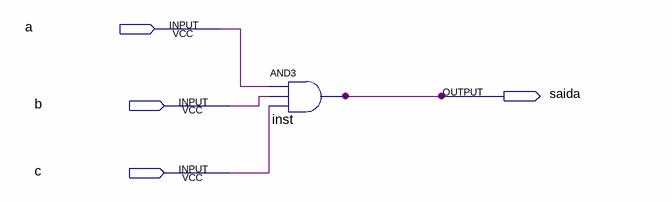
[diagram p0: schematic sheet]
// Quartus schematic teste.bdf as structural Verilog: 1 symbols, 4 pins
module teste (
  input  a,
  input  b,
  input  c,
  output saida
);

  and inst (saida, a, b, c);
endmodule
